# Altium project revisi sistem.PrjPcb
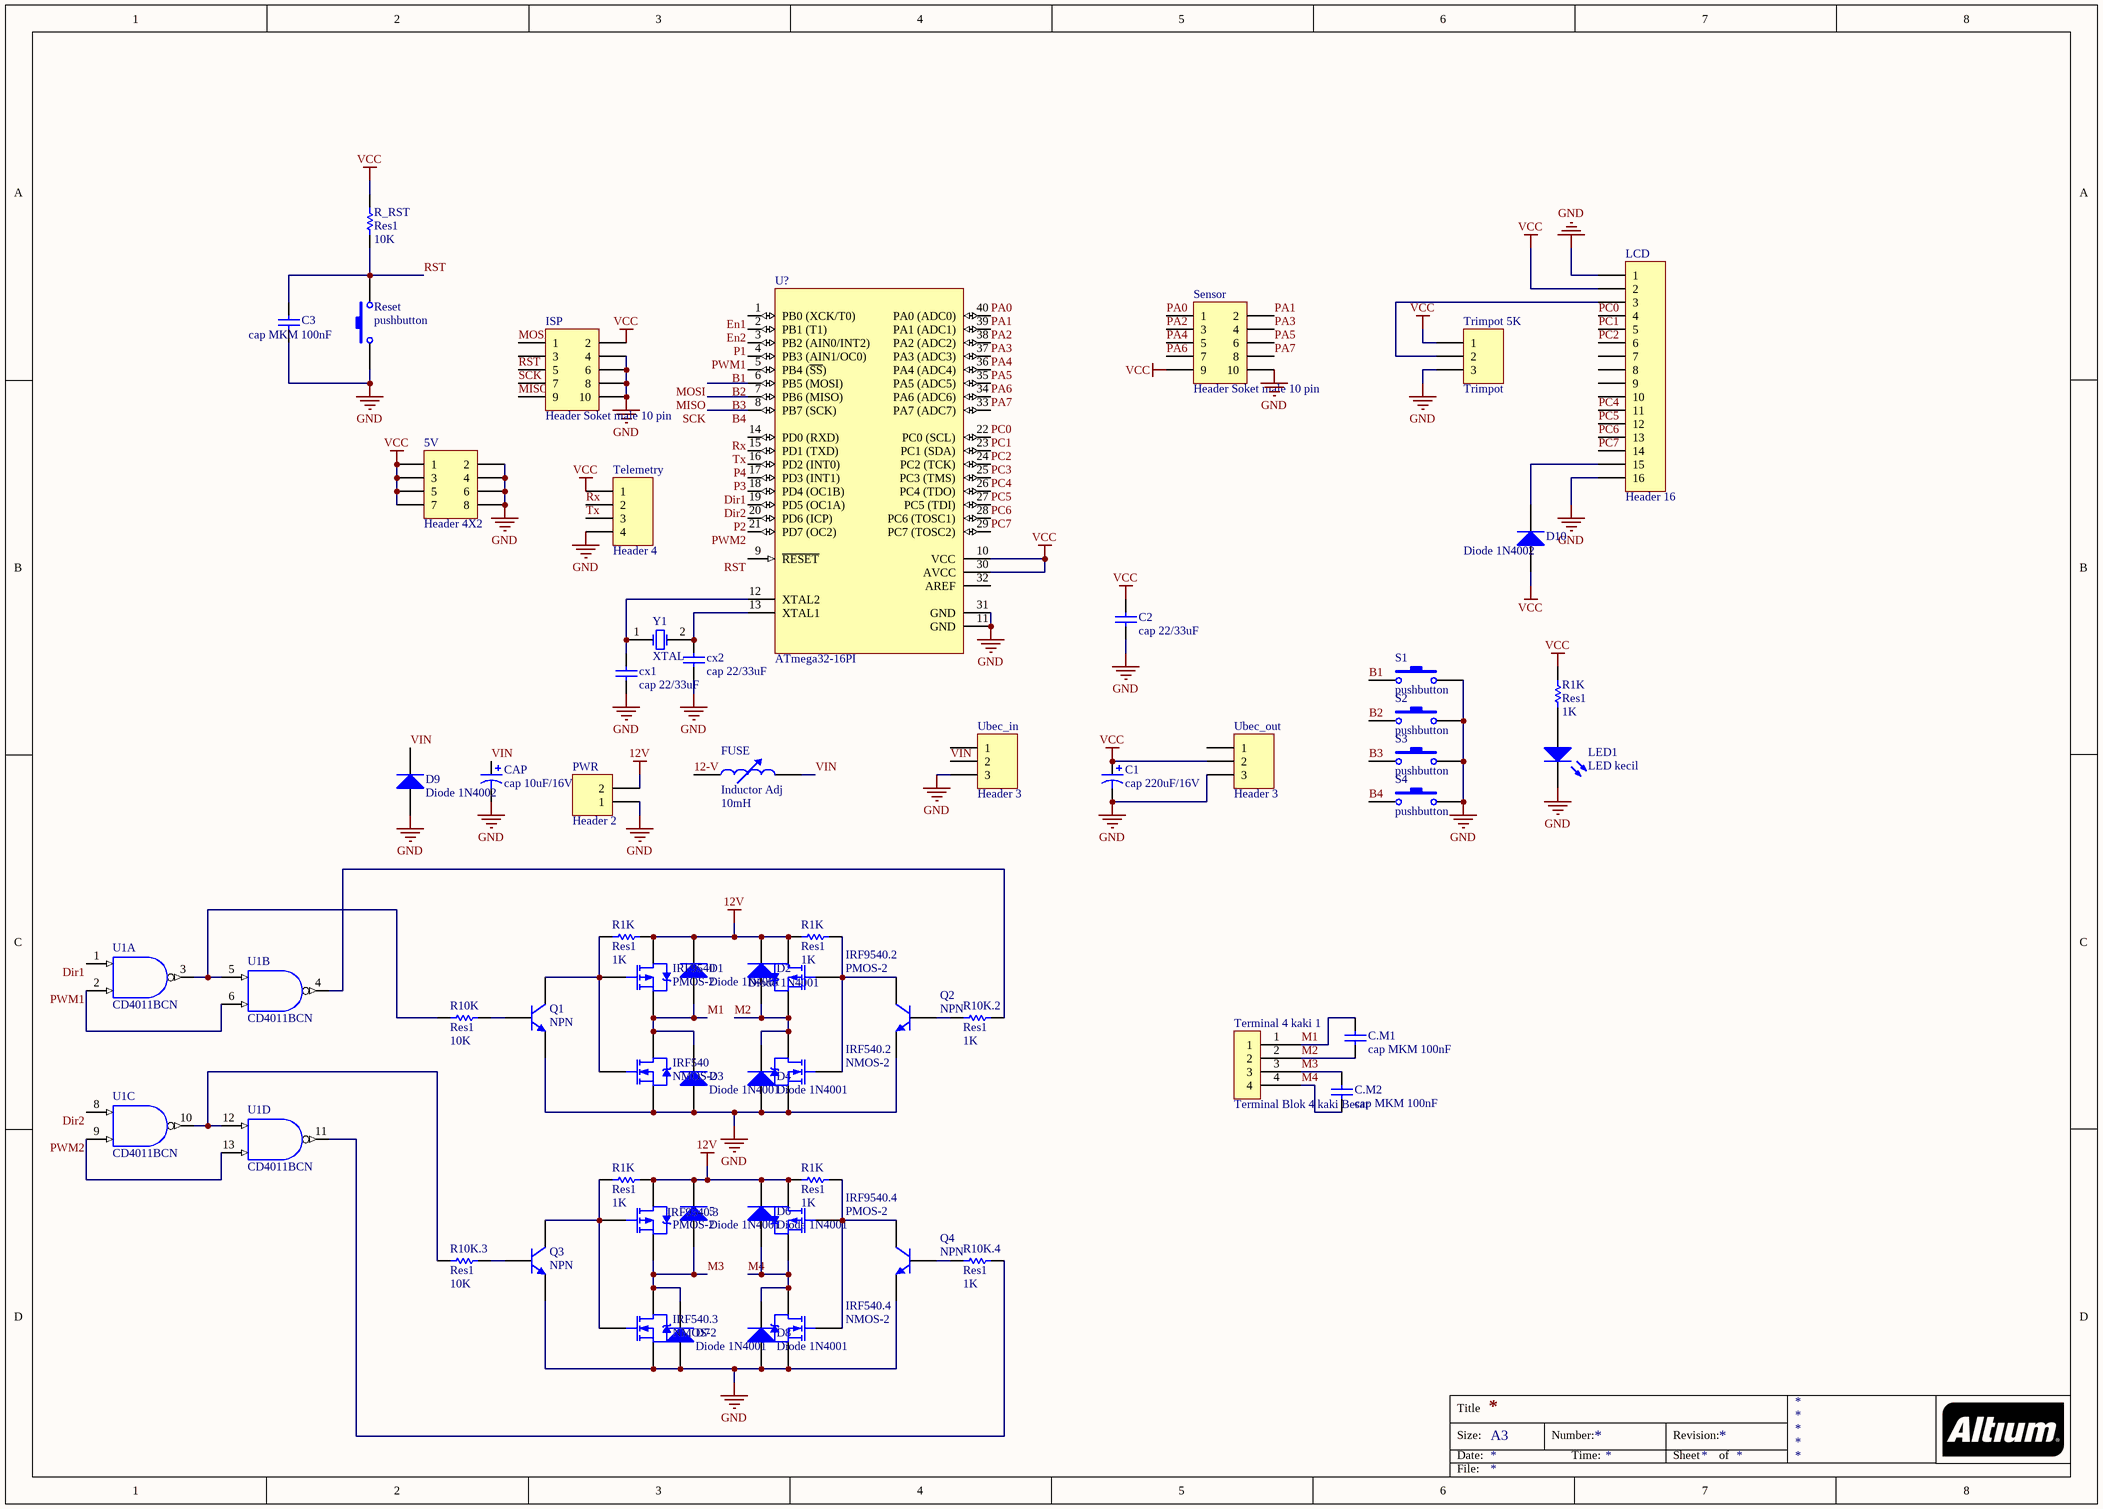
[diagram p0: revisi sistem.SchDoc]
1 sheet, 60 parts. Net scope: global (net labels, ports and power ports of the same name join across sheets).
Board file: revisi sistem.PcbDoc

## Sheet revisi sistem.SchDoc
size A3

### Parts
(Parts that share a designator on the sheet are numbered #1, #2 ... from top to bottom, then left to right.)
5  Diode 1N4001  [DIO10.46-5.3x2.8]
5V  Header 4X2  [HDR2X4]
AT_MEGA_16/32/8535  ATmega32-16PI  [40P6]
C1  cap 220uF/16V  [cap 220uF/16V]
C2  cap 22/33uF  [cap 22/33uF]
C3  cap MKM 100nF  [cap MKM 100nF diri]
C.M1  cap MKM 100nF  [cap MKM 100nF diri]
C.M2  cap MKM 100nF  [cap MKM 100nF diri]
CAP  cap 10uF/16V  [cap 10uF/16V]
cx1  cap 22/33uF  [cap 22/33uF]
cx2  cap 22/33uF  [cap 22/33uF]
D1  Diode 1N4001  [DIO10.46-5.3x2.8]
D2  Diode 1N4001  [DIO10.46-5.3x2.8]
D3  Diode 1N4001  [DIO10.46-5.3x2.8]
D4  Diode 1N4001  [DIO10.46-5.3x2.8]
D6  Diode 1N4001  [DIO10.46-5.3x2.8]
D7  Diode 1N4001  [DIO10.46-5.3x2.8]
D8  Diode 1N4001  [DIO10.46-5.3x2.8]
D9  Diode 1N4002  [DIO10.46-5.3x2.8]
D10  Diode 1N4002  [DIO10.46-5.3x2.8]
FUSE  Inductor Adj  value 10mH  [AXIAL-0.8]
IRF540  NMOS-2  [SFM-T3/A4.7V]
IRF540.2  NMOS-2  [SFM-T3/A4.7V]
IRF540.3  NMOS-2  [SFM-T3/A4.7V]
IRF540.4  NMOS-2  [SFM-T3/A4.7V]
IRF9540  PMOS-2  [SFM-T3/A4.7V]
IRF9540.2  PMOS-2  [SFM-T3/A4.7V]
IRF9540.3  PMOS-2  [SFM-T3/A4.7V]
IRF9540.4  PMOS-2  [SFM-T3/A4.7V]
ISP  Header Soket male 10 pin  [Header Soket male 10 pin]
LCD  Header 16  [HDR1X16]
LED1  LED kecil  [LED kecil]
PWR  Header 2  [HDR1X2]
Q1  NPN  [BCY-W3]
Q2  NPN  [BCY-W3]
Q3  NPN  [BCY-W3]
Q4  NPN  [BCY-W3]
R1K#1  Res1  value 1K  [AXIAL-0.3]
R1K#2  Res1  value 1K  [AXIAL-0.3]
R1K#3  Res1  value 1K  [AXIAL-0.3]
R1K#4  Res1  value 1K  [AXIAL-0.3]
R1K#5  Res1  value 1K  [AXIAL-0.3]
R10K  Res1  value 10K  [AXIAL-0.3]
R10K.2  Res1  value 1K  [AXIAL-0.3]
R10K.3  Res1  value 10K  [AXIAL-0.3]
R10K.4  Res1  value 1K  [AXIAL-0.3]
R_RST  Res1  value 10K  [AXIAL-0.3]
Reset  pushbutton  [pushbutton]
S1  pushbutton  [pushbutton]
S2  pushbutton  [pushbutton]
S3  pushbutton  [pushbutton]
S4  pushbutton  [pushbutton]
Sensor  Header Soket male 10 pin  [Header Soket male 10 pin]
Telemetry  Header 4  [HDR1X4]
Terminal_4_kaki_1  Terminal Blok 4 kaki Besar  [TERMINAL 4 KAKI]
Trimpot_5K  Trimpot  [Trimpot Duduk]
U1  CD4011BCN  [N14A]  (parts A,B,C,D of 4)
Ubec_in  Header 3  [HDR1X3]
Ubec_out  Header 3  [HDR1X3]
Y1  XTAL  [XTAL]

### Nets
12V: 5.2(K) D1.2(K) D2.2(K) D6.2(K) IRF9540.2(D) IRF9540.2.2(D) IRF9540.3.2(D) IRF9540.4.2(D) PWR.2 R1K#2.2 R1K#3.1 R1K#4.2 R1K#5.1
GND: 5V.2 5V.4 5V.6 5V.8 AT_MEGA_16/32/8535.11(GND) AT_MEGA_16/32/8535.31(GND) C1.2 C2.1 C3.1 CAP.2 cx1.1 cx2.1 D3.1(A) D4.1(A) D7.1(A) D8.1(A) D9.1(A) IRF540.3(S) IRF540.2.3(S) IRF540.3.3(S) IRF540.4.3(S) ISP.4 ISP.6 ISP.8 ISP.10 LCD.1 LCD.16 LED1.2(K) PWR.1 Q1.3(E) Q2.3(E) Q3.3(E) Q4.3(E) Reset.1 S1.2 S2.2 S3.2 S4.2 Sensor.10 Telemetry.4 Trimpot_5K.3 U1.7(GND) Ubec_in.3 Ubec_out.3
VCC: 5V.1 5V.3 5V.5 5V.7 AT_MEGA_16/32/8535.10(VCC) AT_MEGA_16/32/8535.30(AVCC) C1.1 C2.2 D10.1(A) ISP.2 LCD.2 R1K#1.2 R_RST.2 Sensor.9 Telemetry.1 Trimpot_5K.1 Ubec_out.2
VDD: U1.14(VDD)
12-V: FUSE.1
B1: AT_MEGA_16/32/8535.5(PB4_(~{SS})) S1.1
B2: AT_MEGA_16/32/8535.6(PB5_(MOSI)) ISP.1 S2.1  [also labelled MOSI]
B3: AT_MEGA_16/32/8535.7(PB6_(MISO)) ISP.9 S3.1  [also labelled MISO]
B4: AT_MEGA_16/32/8535.8(PB7_(SCK)) ISP.7 S4.1  [also labelled SCK]
Dir1: AT_MEGA_16/32/8535.18(PD4_(OC1B)) U1.1(A)
Dir2: AT_MEGA_16/32/8535.19(PD5_(OC1A)) U1.8(A)
En1: AT_MEGA_16/32/8535.1(PB0_(XCK/T0))
En2: AT_MEGA_16/32/8535.2(PB1_(T1))
M1: C.M1.2 D1.1(A) D3.2(K) IRF540.2(D) IRF9540.3(S) Terminal_4_kaki_1.1
M2: C.M1.1 D2.1(A) D4.2(K) IRF540.2.2(D) IRF9540.2.3(S) Terminal_4_kaki_1.2
M3: 5.1(A) C.M2.2 D7.2(K) IRF540.3.2(D) IRF9540.3.3(S) Terminal_4_kaki_1.3
M4: C.M2.1 D6.1(A) D8.2(K) IRF540.4.2(D) IRF9540.4.3(S) Terminal_4_kaki_1.4
P1: AT_MEGA_16/32/8535.3(PB2_(AIN0/INT2))
P2: AT_MEGA_16/32/8535.20(PD6_(ICP))
P3: AT_MEGA_16/32/8535.17(PD3_(INT1))
P4: AT_MEGA_16/32/8535.16(PD2_(INT0))
PA0: AT_MEGA_16/32/8535.40(PA0_(ADC0)) Sensor.1
PA1: AT_MEGA_16/32/8535.39(PA1_(ADC1)) Sensor.2
PA2: AT_MEGA_16/32/8535.38(PA2_(ADC2)) Sensor.3
PA3: AT_MEGA_16/32/8535.37(PA3_(ADC3)) Sensor.4
PA4: AT_MEGA_16/32/8535.36(PA4_(ADC4)) Sensor.5
PA5: AT_MEGA_16/32/8535.35(PA5_(ADC5)) Sensor.6
PA6: AT_MEGA_16/32/8535.34(PA6_(ADC6)) Sensor.7
PA7: AT_MEGA_16/32/8535.33(PA7_(ADC7)) Sensor.8
PC0: AT_MEGA_16/32/8535.22(PC0_(SCL)) LCD.4
PC1: AT_MEGA_16/32/8535.23(PC1_(SDA)) LCD.5
PC2: AT_MEGA_16/32/8535.24(PC2_(TCK)) LCD.6
PC3: AT_MEGA_16/32/8535.25(PC3_(TMS))
PC4: AT_MEGA_16/32/8535.26(PC4_(TDO)) LCD.11
PC5: AT_MEGA_16/32/8535.27(PC5_(TDI)) LCD.12
PC6: AT_MEGA_16/32/8535.28(PC6_(TOSC1)) LCD.13
PC7: AT_MEGA_16/32/8535.29(PC7_(TOSC2)) LCD.14
PWM1: AT_MEGA_16/32/8535.4(PB3_(AIN1/OC0)) U1.2(B) U1.6(B)
PWM2: AT_MEGA_16/32/8535.21(PD7_(OC2)) U1.9(F) U1.13(B)
RST: AT_MEGA_16/32/8535.9(~{RESET}) C3.2 ISP.5 R_RST.1 Reset.2
Rx: AT_MEGA_16/32/8535.14(PD0_(RXD)) Telemetry.2
Tx: AT_MEGA_16/32/8535.15(PD1_(TXD)) Telemetry.3
VIN: CAP.1 D9.2(K) FUSE.2 Ubec_in.2
NetAT_MEGA_16/32/8535_12: AT_MEGA_16/32/8535.12(XTAL2) cx1.2 Y1.1(OSC1)
NetAT_MEGA_16/32/8535_13: AT_MEGA_16/32/8535.13(XTAL1) cx2.2 Y1.2(OSC2)
NetD10_2: D10.2(K) LCD.15
NetIRF540.2_1: IRF540.2.1(G) IRF9540.2.1(G) Q2.1(C) R1K#3.2
NetIRF540.3_1: IRF540.3.1(G) IRF9540.3.1(G) Q3.1(C) R1K#4.1
NetIRF540.4_1: IRF540.4.1(G) IRF9540.4.1(G) Q4.1(C) R1K#5.2
NetIRF540_1: IRF540.1(G) IRF9540.1(G) Q1.1(C) R1K#2.1
NetLCD_3: LCD.3 Trimpot_5K.2
NetLED1_1: LED1.1(A) R1K#1.1
NetQ1_2: Q1.2(B) R10K.2
NetQ2_2: Q2.2(B) R10K.2.1
NetQ3_2: Q3.2(B) R10K.3.2
NetQ4_2: Q4.2(B) R10K.4.1
NetR10K.2_2: R10K.2.2 U1.4(J)
NetR10K.3_1: R10K.3.1 U1.10(J) U1.12(A)
NetR10K.4_2: R10K.4.2 U1.11(J)
NetR10K_1: R10K.1 U1.3(J) U1.5(A)

Not connected (* = marked no-connect by the designer): AT_MEGA_16/32/8535 32(AREF); ISP 3; LCD 7 8 9 10; Ubec_in 1; Ubec_out 1

### Notes on the sheet
- Title
- Size:
- Date:
- A3
- Number:
- Time:
- Revision:
- Sheet
- of
- File:

### Library data of the parts
5 D1-D4 D6-D8 = Diode 1N4001: 1 Amp General Purpose Rectifier; Published: 8-Jun-2000; LatestRevisionDate: 17-Jul-2002; LatestRevisionNote: Re-released for DXP Platform.; DatasheetVersion: 1998; PackageVersion: Aug-1999; PackageReference: DO-41; Publisher: Altium Limited; Code_JEDEC: DO-204-AL; ComponentLink1Description: Manufacturer Link; ComponentLink1URL: http://www.fairchildsemi.com/; ComponentLink2Description: Datasheet; ComponentLink2URL: http://www.fairchildsemi.com/ds/1N%2F1N4001.pdf
5V = Header 4X2: Header, 4-Pin, Dual row; LatestRevisionDate: 17-Jul-2002; LatestRevisionNote: Re-released for DXP Platform.; Publisher: Altium Limited
AT_MEGA_16/32/8535 = ATmega32-16PI: 8-Bit AVR Microcontroller with 32K Bytes of In-System Programmable Flash Memory
D9 D10 = Diode 1N4002: 1 Amp General Purpose Rectifier; Published: 8-Jun-2000; LatestRevisionDate: 17-Jul-2002; LatestRevisionNote: Re-released for DXP Platform.; DatasheetVersion: 1998; PackageVersion: Aug-1999; PackageReference: DO-41; Publisher: Altium Limited; Code_JEDEC: DO-204-AL; ComponentLink1Description: Manufacturer Link; ComponentLink1URL: http://www.fairchildsemi.com/; ComponentLink2Description: Datasheet; ComponentLink2URL: http://www.fairchildsemi.com/ds/1N%2F1N4001.pdf
FUSE = Inductor Adj: Adjustable Inductor; Set Position: 0.5; Published: 24-Mar-1999; LatestRevisionDate: 17-Jul-2002; LatestRevisionNote: Re-released for DXP Platform.; PackageReference: AXIAL-0.8; Publisher: Altium Limited
IRF540 IRF540.2-IRF540.4 = NMOS-2: N-Channel Power MOSFET; Note: Pin 2 is electrically connected to pin 4.; Published: 8-Jun-2000; LatestRevisionDate: 17-Jul-2002; LatestRevisionNote: Re-released for DXP Platform.; DatasheetVersion: PD-9.814; PackageReference: TO-220AB; Publisher: Altium Limited; Code_JEDEC: TO-220-AB; ComponentLink1Description: Manufacturer Link; ComponentLink1URL: http://www.irf.com/
IRF9540 IRF9540.2-IRF9540.4 = PMOS-2: P-Channel Power MOSFET; Note: Pin 4 not drawn and electrically connected to Pin 2.; Published: 8-Jun-2000; LatestRevisionDate: 17-Jul-2002; LatestRevisionNote: Re-released for DXP Platform.; DatasheetVersion: PD-9.390D; PackageReference: TO-220AB; Publisher: Altium Limited; Code_JEDEC: TO-220-AB; ComponentLink1Description: Manufacturer Link; ComponentLink1URL: http://www.irf.com/
LCD = Header 16: Header, 16-Pin; LatestRevisionDate: 17-Jul-2002; LatestRevisionNote: Re-released for DXP Platform.; Publisher: Altium Limited
PWR = Header 2: Header, 2-Pin; LatestRevisionDate: 17-Jul-2002; LatestRevisionNote: Re-released for DXP Platform.; Publisher: Altium Limited
Q1-Q4 = NPN: NPN Bipolar Transistor; Published: 8-Jun-2000; LatestRevisionDate: 17-Jul-2002; LatestRevisionNote: Re-released for DXP Platform.; PackageReference: TO-226; Publisher: Altium Limited; Code_JEDEC: TO-226-AA
R1K#1-R1K#5 R10K R10K.2-R10K.4 R_RST = Res1: Resistor; Published: 8-Jun-2000; LatestRevisionDate: 17-Jul-2002; LatestRevisionNote: Re-released for DXP Platform.; PackageReference: AXIAL-0.3; Publisher: Altium Limited
Telemetry = Header 4: Header, 4-Pin; LatestRevisionDate: 17-Jul-2002; LatestRevisionNote: Re-released for DXP Platform.; Publisher: Altium Limited
Terminal_4_kaki_1 = Terminal Blok 4 kaki
Trimpot_5K = Trimpot Duduk
U1 = CD4011BCN: Quad 2-Input NAND Buffered B series Gate, 14-Pin PDIP; IC_Technology: C; Published: 17-Jul-2002; LatestRevisionDate: 29-May-2009; LatestRevisionNote: Component Body Added.; DatasheetVersion: Jan-1999; PackageVersion: 2000; PackageReference: N14A; Publisher: Altium Limited; PackageDescription: DIP, 14-Pin, Row Spacing 7.62 mm, Pitch 2.54 mm; ComponentLink1Description: Manufacturer Link; ComponentLink1URL: http://www.fairchildsemi.com/; ComponentLink2Description: Datasheet; ComponentLink2URL: http://www.fairchildsemi.com/ds/CD%2FCD4001BC.pdf
Ubec_in Ubec_out = Header 3: Header, 3-Pin; LatestRevisionDate: 17-Jul-2002; LatestRevisionNote: Re-released for DXP Platform.; Publisher: Altium Limited